# EAGLE schematic RBCX (EAGLE 9.6.2), part 3 of 3
## Sheet 8 of 8: Coprocessor
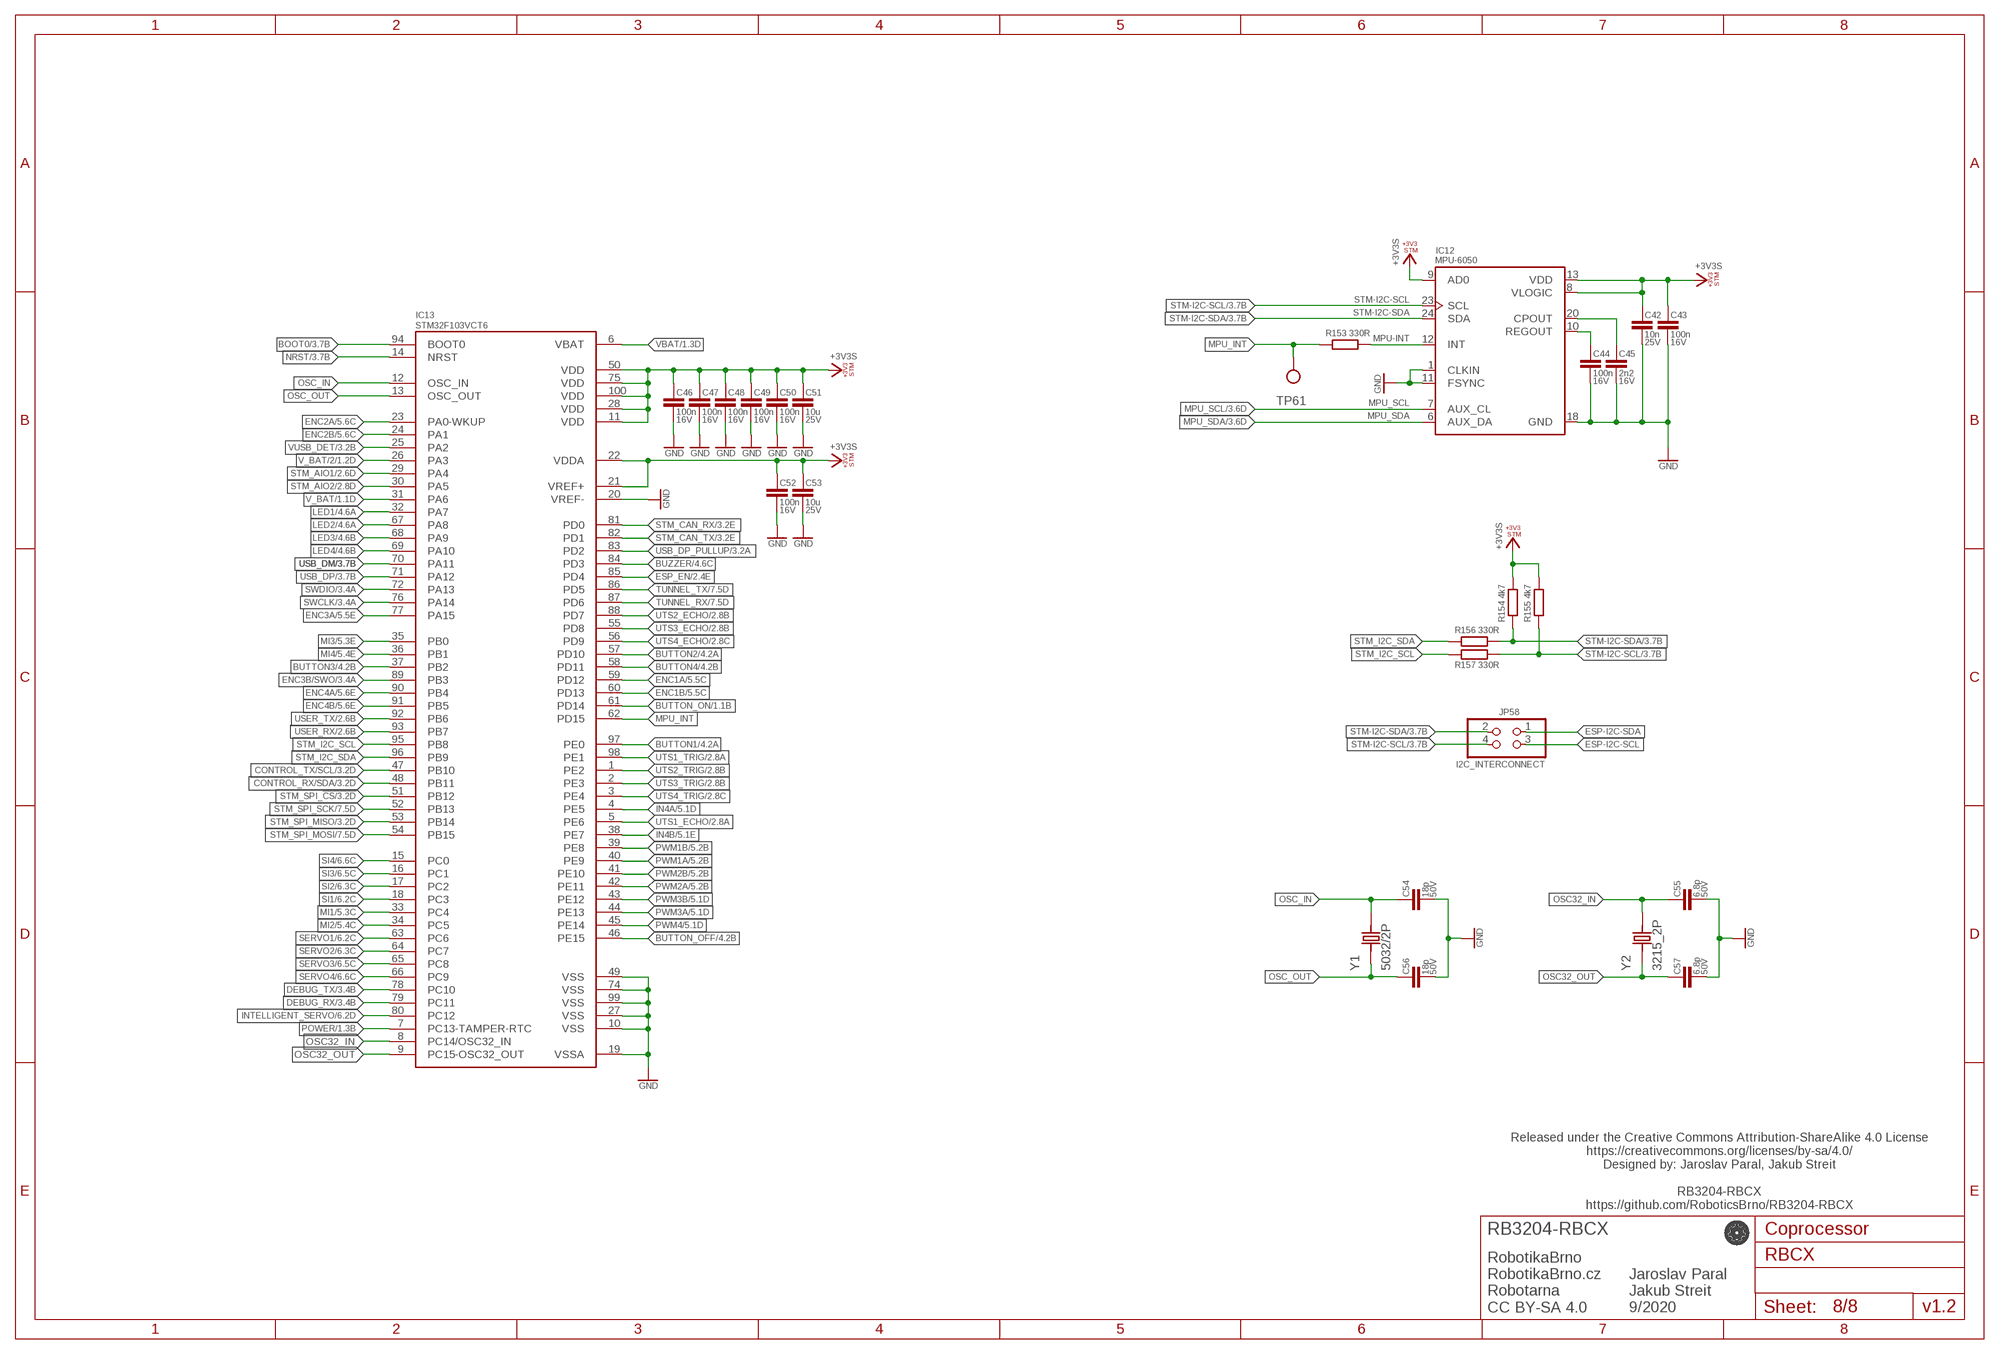
[diagram p13: schematic, sheet 8]

### Parts
C42  10n  C-EUC0402  [C0402]  (not fitted in variant TOP_SMD_WITHOUT_MPU)  (not fitted in variant TOP_SMD_WITHOUT_MOTOR_CURRENT)  (not fitted in variant TOP_SMD_WITHOUT_SERVO_CURRENT)  (not fitted in variant TOP_SMD_WITHOUT_CURRENT)  (not fitted in variant TOP_SMD_MINIMAL)
C43  100n  C-EUC0402  [C0402]  (not fitted in variant TOP_SMD_WITHOUT_MPU)  (not fitted in variant TOP_SMD_WITHOUT_MOTOR_CURRENT)  (not fitted in variant TOP_SMD_WITHOUT_SERVO_CURRENT)  (not fitted in variant TOP_SMD_WITHOUT_CURRENT)  (not fitted in variant TOP_SMD_MINIMAL)
C44  100n  C-EUC0402  [C0402]  (not fitted in variant TOP_SMD_WITHOUT_MPU)  (not fitted in variant TOP_SMD_WITHOUT_MOTOR_CURRENT)  (not fitted in variant TOP_SMD_WITHOUT_SERVO_CURRENT)  (not fitted in variant TOP_SMD_WITHOUT_CURRENT)  (not fitted in variant TOP_SMD_MINIMAL)
C45  2n2  C-EUC0402  [C0402]  (not fitted in variant TOP_SMD_WITHOUT_MPU)  (not fitted in variant TOP_SMD_WITHOUT_MOTOR_CURRENT)  (not fitted in variant TOP_SMD_WITHOUT_SERVO_CURRENT)  (not fitted in variant TOP_SMD_WITHOUT_CURRENT)  (not fitted in variant TOP_SMD_MINIMAL)
C46  100n  C-EUC0402  [C0402]
C47  100n  C-EUC0402  [C0402]
C48  100n  C-EUC0402  [C0402]
C49  100n  C-EUC0402  [C0402]
C50  100n  C-EUC0402  [C0402]
C51  10u  C-EUC0805  [C0805]
C52  100n  C-EUC0402  [C0402]
C53  10u  C-EUC0805  [C0805]
C54  18p  C-EUC0402  [C0402]
C55  6.8p  C-EUC0402  [C0402]  (not fitted in variant TOP_SMD_MINIMAL)
C56  18p  C-EUC0402  [C0402]
C57  6.8p  C-EUC0402  [C0402]  (not fitted in variant TOP_SMD_MINIMAL)
IC12  MPU-6050  [QFN50P400X400X95-24N]  (not fitted in variant TOP_SMD_WITHOUT_MPU)  (not fitted in variant TOP_SMD_WITHOUT_MOTOR_CURRENT)  (not fitted in variant TOP_SMD_WITHOUT_SERVO_CURRENT)  (not fitted in variant TOP_SMD_WITHOUT_CURRENT)  (not fitted in variant TOP_SMD_MINIMAL)
IC13  STM32F103VCT6  [QFP50P1600X1600X160-100N_STM32F103VCT6]
JP58  I2C_INTERCONNECT  PINHD-2X2  [2X02]  (not fitted in variant TOP_SMD_FULL)  (not fitted in variant TOP_SMD_WITHOUT_MPU)  (not fitted in variant TOP_SMD_WITHOUT_MOTOR_CURRENT)  (not fitted in variant TOP_SMD_WITHOUT_SERVO_CURRENT)  (not fitted in variant TOP_SMD_WITHOUT_CURRENT)  (not fitted in variant TOP_SMD_MINIMAL)
R153  330R  R-EU_R0402  [R0402]  (not fitted in variant TOP_SMD_WITHOUT_MPU)  (not fitted in variant TOP_SMD_WITHOUT_MOTOR_CURRENT)  (not fitted in variant TOP_SMD_WITHOUT_SERVO_CURRENT)  (not fitted in variant TOP_SMD_WITHOUT_CURRENT)  (not fitted in variant TOP_SMD_MINIMAL)
R154  4k7  R-EU_R0402  [R0402]  (not fitted in variant TOP_SMD_MINIMAL)
R155  4k7  R-EU_R0402  [R0402]  (not fitted in variant TOP_SMD_MINIMAL)
R156  330R  R-EU_R0402  [R0402]  (not fitted in variant TOP_SMD_MINIMAL)
R157  330R  R-EU_R0402  [R0402]  (not fitted in variant TOP_SMD_MINIMAL)
TP61  TP_06MM  [TP_06]  (not fitted in variant TOP_SMD_FULL)  (not fitted in variant TOP_SMD_WITHOUT_MPU)  (not fitted in variant TOP_SMD_WITHOUT_MOTOR_CURRENT)  (not fitted in variant TOP_SMD_WITHOUT_SERVO_CURRENT)  (not fitted in variant TOP_SMD_WITHOUT_CURRENT)  (not fitted in variant TOP_SMD_MINIMAL)
Y1  5032/2P  [OSCCC500X320X135]
Y2  3215_2P  [SMD-3215_2P]  (not fitted in variant TOP_SMD_MINIMAL)

### Nets
+3V3S: C42.1 C43.2 C46.2 C47.2 C48.2 C49.2 C50.2 C51.2 C52.2 C53.2 IC12.8(VLOGIC) IC12.9(AD0) IC12.13(VDD) IC13.11(VDD) IC13.21(VREF+) IC13.22(VDDA) IC13.28(VDD) IC13.50(VDD) IC13.75(VDD) IC13.100(VDD) R154.2 R155.2 ; also sheet 1,2,3,4,5,6
BOOT0: IC13.94(BOOT0) ; also sheet 3
BUTTON1: IC13.97(PE0) ; also sheet 4
BUTTON2: IC13.57(PD10) ; also sheet 4
BUTTON3: IC13.37(PB2) ; also sheet 4
BUTTON4: IC13.58(PD11) ; also sheet 4
BUTTON_OFF: IC13.46(PE15) ; also sheet 4
BUTTON_ON: IC13.61(PD14) ; also sheet 1
BUZZER: IC13.84(PD3) ; also sheet 4
CONTROL_RX/SDA: IC13.48(PB11) ; also sheet 3,7
CONTROL_TX/SCL: IC13.47(PB10) ; also sheet 3,7
CPOUT: C45.2 IC12.20(CPOUT)
DEBUG_RX: IC13.79(PC11) ; also sheet 3
DEBUG_TX: IC13.78(PC10) ; also sheet 3
ENC1A: IC13.59(PD12) ; also sheet 5
ENC1B: IC13.60(PD13) ; also sheet 5
ENC2A: IC13.23(PA0-WKUP) ; also sheet 5
ENC2B: IC13.24(PA1) ; also sheet 5
ENC3A: IC13.77(PA15) ; also sheet 5
ENC3B/SWO: IC13.89(PB3) ; also sheet 3,5
ENC4A: IC13.90(PB4) ; also sheet 5
ENC4B: IC13.91(PB5) ; also sheet 5
ESP-I2C-SCL: JP58.3 ; also sheet 2
ESP-I2C-SDA: JP58.1 ; also sheet 2
ESP_EN: IC13.85(PD4) ; also sheet 2,3,4,7
GND: C42.2 C43.1 C44.1 C45.1 C46.1 C47.1 C48.1 C49.1 C50.1 C51.1 C52.1 C53.1 C54.1 C55.1 C56.1 C57.1 IC12.1(CLKIN) IC12.11(FSYNC) IC12.18(GND) IC13.10(VSS) IC13.19(VSSA) IC13.20(VREF-) IC13.27(VSS) IC13.49(VSS) IC13.74(VSS) IC13.99(VSS) ; also sheet 1,2,3,4,5,6,7
IN4A: IC13.4(PE5) ; also sheet 5
IN4B: IC13.38(PE7) ; also sheet 5
INTELLIGENT_SERVO: IC13.80(PC12) ; also sheet 6
LED1: IC13.32(PA7) ; also sheet 4
LED2: IC13.67(PA8) ; also sheet 4
LED3: IC13.68(PA9) ; also sheet 4
LED4: IC13.69(PA10) ; also sheet 4
MI1: IC13.33(PC4) ; also sheet 5
MI2: IC13.34(PC5) ; also sheet 5
MI3: IC13.35(PB0) ; also sheet 5
MI4: IC13.36(PB1) ; also sheet 5
MPU-INT: IC12.12(INT) R153.2
MPU_INT: IC13.62(PD15) R153.1 TP61.P$1(TP)
MPU_SCL: IC12.7(AUX_CL) ; also sheet 3
MPU_SDA: IC12.6(AUX_DA) ; also sheet 3
NRST: IC13.14(NRST) ; also sheet 3,4
OSC32_IN: C55.2 IC13.8(PC14/OSC32_IN) Y2.2
OSC32_OUT: C57.2 IC13.9(PC15-OSC32_OUT) Y2.1
OSC_IN: C54.2 IC13.12(OSC_IN) Y1.2
OSC_OUT: C56.2 IC13.13(OSC_OUT) Y1.1
POWER: IC13.7(PC13-TAMPER-RTC) ; also sheet 1
PWM1A: IC13.40(PE9) ; also sheet 5
PWM1B: IC13.39(PE8) ; also sheet 5
PWM2A: IC13.42(PE11) ; also sheet 5
PWM2B: IC13.41(PE10) ; also sheet 5
PWM3A: IC13.44(PE13) ; also sheet 5
PWM3B: IC13.43(PE12) ; also sheet 5
PWM4: IC13.45(PE14) ; also sheet 5
REGOUT: C44.2 IC12.10(REGOUT)
SERVO1: IC13.63(PC6) ; also sheet 6
SERVO2: IC13.64(PC7) ; also sheet 6
SERVO3: IC13.65(PC8) ; also sheet 6
SERVO4: IC13.66(PC9) ; also sheet 6
SI1: IC13.18(PC3) ; also sheet 6
SI2: IC13.17(PC2) ; also sheet 6
SI3: IC13.16(PC1) ; also sheet 6
SI4: IC13.15(PC0) ; also sheet 6
STM-I2C-SCL: IC12.23(SCL) JP58.4 R155.1 R157.2 ; also sheet 3,4
STM-I2C-SDA: IC12.24(SDA) JP58.2 R154.1 R156.2 ; also sheet 3,4
STM_AIO1: IC13.29(PA4) ; also sheet 2
STM_AIO2: IC13.30(PA5) ; also sheet 2
STM_CAN_RX: IC13.81(PD0) ; also sheet 3
STM_CAN_TX: IC13.82(PD1) ; also sheet 3
STM_I2C_SCL: IC13.95(PB8) R157.1
STM_I2C_SDA: IC13.96(PB9) R156.1
STM_SPI_!CS: IC13.51(PB12) ; also sheet 3,7
STM_SPI_MISO: IC13.53(PB14) ; also sheet 3,7
STM_SPI_MOSI: IC13.54(PB15) ; also sheet 7
STM_SPI_SCK: IC13.52(PB13) ; also sheet 7
SWCLK: IC13.76(PA14) ; also sheet 3
SWDIO: IC13.72(PA13) ; also sheet 3
TUNNEL_RX: IC13.87(PD6) ; also sheet 7
TUNNEL_TX: IC13.86(PD5) ; also sheet 7
USB_DM: IC13.70(PA11) ; also sheet 3
USB_DP: IC13.71(PA12) ; also sheet 3
USB_DP_PULLUP: IC13.83(PD2) ; also sheet 3
USER_RX: IC13.93(PB7) ; also sheet 2
USER_TX: IC13.92(PB6) ; also sheet 2
UTS1_ECHO: IC13.5(PE6) ; also sheet 2
UTS1_TRIG: IC13.98(PE1) ; also sheet 2
UTS2_ECHO: IC13.88(PD7) ; also sheet 2
UTS2_TRIG: IC13.1(PE2) ; also sheet 2
UTS3_ECHO: IC13.55(PD8) ; also sheet 2
UTS3_TRIG: IC13.2(PE3) ; also sheet 2
UTS4_ECHO: IC13.56(PD9) ; also sheet 2
UTS4_TRIG: IC13.3(PE4) ; also sheet 2
V_BAT: IC13.31(PA6) ; also sheet 1
V_BAT/2: IC13.26(PA3) ; also sheet 1
VBAT: IC13.6(VBAT) ; also sheet 1
VUSB_DET: IC13.25(PA2) ; also sheet 3

### Notes on the sheet
- Released under the Creative Commons Attribution-ShareAlike 4.0 License
  https://creativecommons.org/licenses/by-sa/4.0/
  Designed by: Jaroslav Paral, Jakub Streit
  
  RB3204-RBCX
  https://github.com/RoboticsBrno/RB3204-RBCX
- RB3204-RBCX
- RobotikaBrno
  RobotikaBrno.cz
  Robotarna
  CC BY-SA 4.0
- Jaroslav Paral
  Jakub Streit
  9/2020
- v1.2

## Library data of the parts
B1 = piezo:PIEZO
BAT1 = CR2032-circle:CR2032; DESCRIPTION: SMD BATTERY HOLDERS, CLIPS & CONTACTS ROHS; LCSC_ID: C70377; MF_ID: CR2032-BS-6-1; PACKAGE: SMD-BAT-CR2032-BS-6-1; PRICE_10PLUS: $0.0972; PRICE_1PLUS: $0.1305
C1 C2 C24-C27 C40 = rcl_upravena:CPOL-EU: POLARIZED CAPACITOR, European symbol; VOLTAGE: 16V
C3 C4 C14 C15 C19 C20 C36-C39 C41 C42 C51 C53 = rcl_upravena:C-EU: CAPACITOR, European symbol; DIELECTRIC: X5R; VOLTAGE: 25V
C5-C13 C16-C18 C21-C23 C28-C35 C43-C50 C52 = rcl_upravena:C-EU: CAPACITOR, European symbol; DIELECTRIC: X5R; VOLTAGE: 16V
C54-C57 = rcl_upravena:C-EU: CAPACITOR, European symbol; DIELECTRIC: np0; VOLTAGE: 50V
D1 D10 D14 D15 D20 = diode:SHOTTKY; DESCRIPTION: 40V 1A 600mV @ 1A SOD-123 Schottky Barrier Diodes (SBD) RoHS; EXTENDED: NO; LCSC_ID: C305445; MF: Foshan Blue Rocket Elec; MF_ID: B5819W; PACKAGE: SOD-123; PADS: 2; PRICE_100PLUS: $0.0176; PRICE_1PLUS: $0.0342; PRICE_DATE: 17.03.2020
D2-D8 D12 D29-D32 D38 = diode:SHOTTKY
D9 D16-D19 D22-D25 D33-D37 = diode:BAS40-04: Silicon Schottky Diodes General-purpose diode for high-speed switching
D11 D13 D21 D26-D28 = diode:BAS40-05: Silicon Schottky Diodes General-purpose diode for high-speed switching
IC1 = ams1117:AMS1117: VOLTAGE REGULATOR
IC2 IC5 = DRV8833:DRV8833
IC3 IC4 IC6-IC11 = INA180:INA180; DESCRIPTION: PMIC - CURRENT & POWER MONITORS & REGULATORS 1 200 V/V ±0.1% 105KHZ -0.2V ~ 26V 2.7V ~ 5.5V SOT-23-5 ROHS; LCSC_ID: C133969; MF: TI; MF_ID: INA180A4IDBVT; PACKAGE: SOT-23-5; PRICE_100PLUS: $0.2638; PRICE_10PLUS: $0.2986; PRICE_1PLUS: $0.3943; PRICE_30PLUS: $0.2812; PRICE_500PLUS: $0.2566
IC12 = MPU-6050:MPU-6050: MPU-6050 Six-Axis (Gyro + Accelerometer) MEMS MotionTracking™ Devices; AVAILABILITY: Unavailable; DESCRIPTION: 3-axis gyroscope, 3-axis accelerometer in a 4x4x0.9 housing; MF: TDK InvenSense; MP: MPU-6050; PACKAGE: QFN-24 InvenSense; PRICE: None
IC13 = STM32F103VCT6:STM32F103VCT6: Mainstream Performance line, ARM Cortex-M3 MCU with 512 Kbytes Flash, 72 MHz CPU, motor control, USB and CAN; DESCRIPTION: ARM® Cortex®-M3 STM32F1 Microcontroller IC 32-Bit 72MHz 256KB _256K x 8_ FLASH; DIGI-KEY_PART_NUMBER: 497-9034-ND; DIGI-KEY_PURCHASE_URL: https://www.digikey.be/product-detail/en/stmicroelectronics/STM32F103VCT6/497-9034-ND/2035333?utm_source=snapeda&utm_medium=aggregator&utm_campaign=symbol; MF: STMicroelectronics; MP: STM32F103VCT6; PACKAGE: LQFP-100 STMicroelectronics
IM1 IM2 IM5-IM8 = StepDown:STEPDOWN
IM3 = diy-modules:DISPLAY-OLED-128X64-I2C: 128x64 Dot Matrix OLED Module based on SSD1306 chip Variant with I2C interface More details available here: http://www.instructables.com/id/Monochrome-096-i2c-OLED-display-with-arduino-SSD13/ SSD1306 datasheet: https://cdn-shop.adafruit.com/datasheets/SSD1306.pdf Click here to find device on ebay.com <http://www.ebay.com/sch/oled+display+128x64+iic> Note: There are two variants: I2C and SPI. Search for the proper version.
IM4 = diy-modules:DISPLAY-OLED-128X32: 128x32 Dot Matrix OLED Module with I2C interface based on SSD1306 chip More details available here: http://www.tinyosshop.com/index.php?route=product/product&product_id=953 Schematic available here: http://www.tinyosshop.com/datasheet/OLED%2012832.pdf SSD1306 datasheet: https://cdn-shop.adafruit.com/datasheets/SSD1306.pdf Click here to find device on ebay.com <http://www.ebay.com/sch/oled+display+128x32+i2c>
IM9 = esp32:DEVKITC
JP1 JP27 JP44 JP46-JP51 = pinhead:PINHD-1X1: PIN HEADER
JP2-JP5 JP29 JP42 JP43 JP45 = pinhead:PINHD-2X4: PIN HEADER
JP6 JP7 JP9 JP13 JP14 JP16 JP18 JP20 JP22 JP23 JP28 JP34 JP35 JP38 JP40 = pinhead:PINHD-1X4: PIN HEADER
JP8 JP15 JP21 JP33 JP37 JP39 JP41 = pinhead:PINHD-1X6: PIN HEADER
JP10-JP12 JP17 JP19 JP24-JP26 JP30 JP31 JP52-JP55 = pinhead:PINHD-1X3: PIN HEADER
JP32 = pinhead:PINHD-1X5: PIN HEADER
JP36 = pinhead:PINHD-1X2: PIN HEADER
JP56 JP57 = jst-ph:JST-PH3; DESCRIPTION: Connector for inteligent servo LewanSoul (e.g. LX-15D); PACKAGE: 292161-3
JP58 = pinhead:PINHD-2X2: PIN HEADER
LED1-LED24 = led:LED: LED
NC1-NC8 = NC:NC: _EXTERNAL_
P1-P4 = jst-ph:JST-PH6
Q1 Q2 = transistors:P-MOSFET; DESCRIPTION: P MOSFET 19V 35A 7mΩ; EXTENDED: YES; LCSC_ID: C193354; MF: Wuxi NCE Power Semiconductor; MF_ID: NCE20P45Q; PACKAGE: DFN-8_EP_3.3x3.3x0.65P; PADS: 8; PRICE_1000PLUS: $0.1218; PRICE_100PLUS: $0.1276; PRICE_10PLUS: $0.1450; PRICE_1PLUS: $0.1928; PRICE_30PLUS: $0.1363; PRICE_500PLUS: $0.1232
Q3-Q10 = transistors:N-MOSFET; DESCRIPTION: N MOSFET 60V 115mA 7Ω; EXTENDED: NO; LCSC_ID: C8545; MF: Changjiang Electronics Tech (CJ); MF_ID: 2N7002; PACKAGE: SOT-23-3; PADS: 3; PRICE_1PLUS: $0.0236; PRICE_200PLUS: $0.0113
R1-R66 R68-R165 = rcl_upravena:R-EU_: RESISTOR, European symbol
R67 = rcl_upravena:R-EU_: RESISTOR, European symbol; EXTENDED: NO; LCSC_ID: C25867; MF: Uniroyal Elec; MF_ID: 0402WGF1501TCE; PACKAGE: R0402; PADS: 2; PRICE_1000PLUS: 0.0003; PRICE_1PLUS: 0.0009
S1-S14 = switch-omron:10-XX: OMRON SWITCH
SJ1-SJ5 SJ8 SJ9 = jumper:SJ2W_DEFAULT: SMD solder JUMPER
SJ6 SJ7 = jumper:SJ2W: SMD solder JUMPER
TP1-TP61 = test_points:TP
X1 = con-wago-508:W237-03P: WAGO SREW CLAMP; OC_FARNELL: unknown; OC_NEWARK: unknown
X2 = con-wago-508:W237-02P: WAGO SREW CLAMP; OC_FARNELL: unknown; OC_NEWARK: unknown
X3 = con-molex:52559-3092: FFC/FPC-to-Board 0.50mm (.020") SMT, Vertical, ZIF Receptacle Source: http://www.molex.com/product/ffc/52559.html; MF: MOLEX; MPN: 52559-3072; OC_FARNELL: unknown; OC_NEWARK: 57J3632
X4 = USB:614105150621: WR-COM Micro USB 2.0 Type AB Vertical 5 Contacts Kind Properties Durability:10 000 Mating cycles Quality Class:10 000 Mating cycles Connector Type:Micro USB Gender:Receptacle Type:Vertical General Information Operating Temperature:-40up to +105 °C Compliance:RoHS Electrical Properties IR 1:1.8A Working Voltage:30V (AC) Withstanding Voltage:100V (AC) Contact Resistance:30 mΩ Material Properties Insulator Material:LCP Insulator Flammability Rating:UL94 V-0 Color:Black Contact Material:Copper Alloy Contact Plating: Gold Contact Type:Stamped Shielding Material:Stainless Steel Shielding Plating:Matte Tin <https://www.we-online.com/catalog/media/o33043v209%20Family_WR-COM_Micro-USB_Type-AB_614105150621.jpg> Details see: https://www.we-online.com/catalog/en/COM_MICRO_TYPE_AB_VERTICAL/ Updated by Yingchun, Shan 2020-01-16 2020 (C) Würth Elektronik; APPLICATION: Micro USB 2.0; DATASHEET-URL: https://www.we-online.com/catalog/datasheet/614105150621.pdf; GERDER: Receptacle; INTERFACE-TYPE: TypeAB; IR1: 1.8A; MOUNT: THT; PACKAGING: Tape and Reel; PART-NUMBER: 614105150621; PINS: 5; TYPE: Vertical; WORKING-VOLTAGE: 30V(AC)
X5 = USB:USB_C_8PIN
Y1 = SMD5032_2P:5032/2P: SMD Crystal 8 Mhz-20pF-10ppm-80R;; AVAILABILITY: Unavailable; DESCRIPTION: SMD Crystal 8Mhz-20pF-10ppm-80R;; LCSC_ID: C115962; MF: Xinhunjing; MF_ID: X50328MSB2GI; MP: 5032/2P; PACKAGE: SMD-5032_2P; PRICE: $0.1707
Y2 = SMD3215_2P:3215_2P: SMD Crystal 32.768 Khz-12.5pF-20ppm; AVAILABILITY: Unavailable; DESCRIPTION: SMD Crystal 32.768Khz-12.5pF-20ppm; LCSC_ID: C32346; MF: Seiko Epson; MF_ID: Q13FC1350000400; MP: 3215/2P; PACKAGE: SMD-5032_2P; PRICE_1PLUS: $0.1544; PRICE_50PLUS: $0.0975

## Net classes
0 default: width 0.15 mm, drill 0.3 mm, clearance 0.15 mm